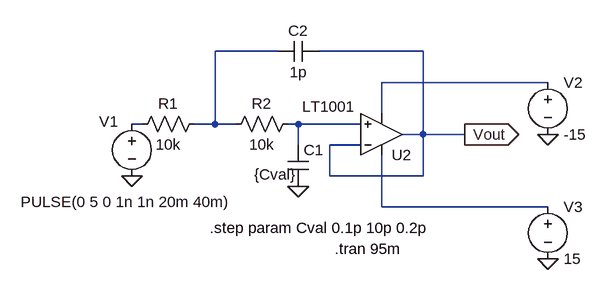
[diagram p0: schematic Sallen_key_short_sweep.asc]
Sallen_key_short_sweep.asc, the LTspice schematic file:
Version 4.1
SHEET 1 880 680
WIRE 96 48 0 48
WIRE 320 48 160 48
WIRE 512 96 256 96
WIRE 256 144 256 96
WIRE -112 160 -128 160
WIRE 0 160 0 48
WIRE 0 160 -32 160
WIRE 32 160 0 160
WIRE 128 160 112 160
WIRE 224 160 128 160
WIRE 320 176 320 48
WIRE 320 176 288 176
WIRE 384 176 320 176
WIRE 128 192 128 160
WIRE 224 192 176 192
WIRE 176 240 176 192
WIRE 320 240 320 176
WIRE 320 240 176 240
WIRE 256 288 256 208
WIRE 512 288 256 288
FLAG 128 256 0
FLAG -128 240 0
FLAG 384 176 Vout
IOPIN 384 176 Out
FLAG 512 176 0
FLAG 512 368 0
SYMBOL cap 112 192 R0
WINDOW 3 -52 46 Left 2
SYMATTR Value {Cval}
SYMATTR InstName C1
SYMBOL res -16 144 R90
WINDOW 0 0 56 VBottom 2
WINDOW 3 32 56 VTop 2
SYMATTR InstName R1
SYMATTR Value 10k
SYMBOL res 128 144 R90
WINDOW 0 0 56 VBottom 2
WINDOW 3 32 56 VTop 2
SYMATTR InstName R2
SYMATTR Value 10k
SYMBOL voltage -128 144 R0
WINDOW 0 -50 12 Left 2
WINDOW 3 -171 136 Left 2
WINDOW 123 0 0 Left 0
WINDOW 39 0 0 Left 0
SYMATTR InstName V1
SYMATTR Value PULSE(0 5 0 1n 1n 20m 40m)
SYMBOL cap 160 32 R90
WINDOW 0 0 32 VBottom 2
WINDOW 3 32 32 VTop 2
SYMATTR InstName C2
SYMATTR Value 1p
SYMBOL OpAmps\\LT1001 256 240 M180
WINDOW 3 -122 107 Left 2
SYMATTR InstName U2
SYMBOL voltage 512 80 R0
WINDOW 123 0 0 Left 0
WINDOW 39 0 0 Left 0
SYMATTR InstName V2
SYMATTR Value -15
SYMBOL voltage 512 272 R0
WINDOW 123 0 0 Left 0
WINDOW 39 0 0 Left 0
SYMATTR InstName V3
SYMATTR Value 15
TEXT 184 352 Left 2 !.tran 95m
TEXT -8 320 Left 2 !.step param Cval 0.1p 10p 0.2p

The netlist it stands for:
* Sallen_key_short_sweep.asc
C1 N004 0 {Cval}
R1 N001 N003 10k
R2 N004 N001 10k
V1 N003 0 PULSE(0 5 0 1n 1n 20m 40m)
C2 Vout N001 1p
X§U2 N004 Vout N005 N002 Vout LT1001  ; pins In+ In- V+ V- OUT
V2 N002 0 -15
V3 N005 0 15
.tran 95m
.step param Cval 0.1p 10p 0.2p
.lib LTC.lib
.backanno
.end